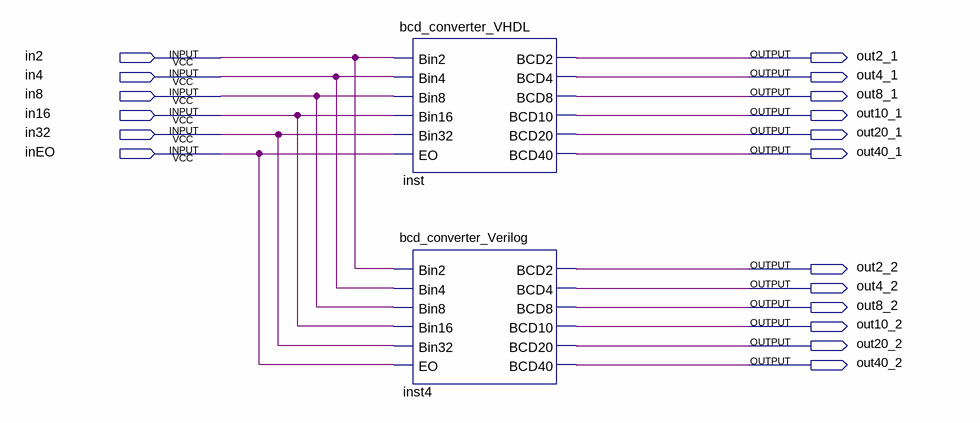
[diagram p0: schematic sheet]
// Quartus schematic lab8_code_converter.bdf as structural Verilog: 2 symbols, 18 pins
module lab8_code_converter (
  input  in2,
  input  in4,
  input  in8,
  input  in16,
  input  in32,
  input  inEO,
  output out2_1,
  output out4_1,
  output out8_1,
  output out10_1,
  output out20_1,
  output out40_1,
  output out2_2,
  output out4_2,
  output out8_2,
  output out10_2,
  output out20_2,
  output out40_2
);

  bcd_converter_VHDL inst (
    .Bin2(in2), .Bin4(in4), .Bin8(in8), .Bin16(in16), .Bin32(in32), .EO(inEO), .BCD2(out2_1), .BCD4(out4_1),
    .BCD8(out8_1), .BCD10(out10_1), .BCD20(out20_1), .BCD40(out40_1));
  bcd_converter_Verilog inst4 (
    .Bin2(in2), .Bin4(in4), .Bin8(in8), .Bin16(in16), .Bin32(in32), .EO(inEO), .BCD2(out2_2), .BCD4(out4_2),
    .BCD8(out8_2), .BCD10(out10_2), .BCD20(out20_2), .BCD40(out40_2));
endmodule
